# EAGLE schematic PSPS_AVNC_SRD_fullBoard-2020-02-06-2 (EAGLE 9.5.1)
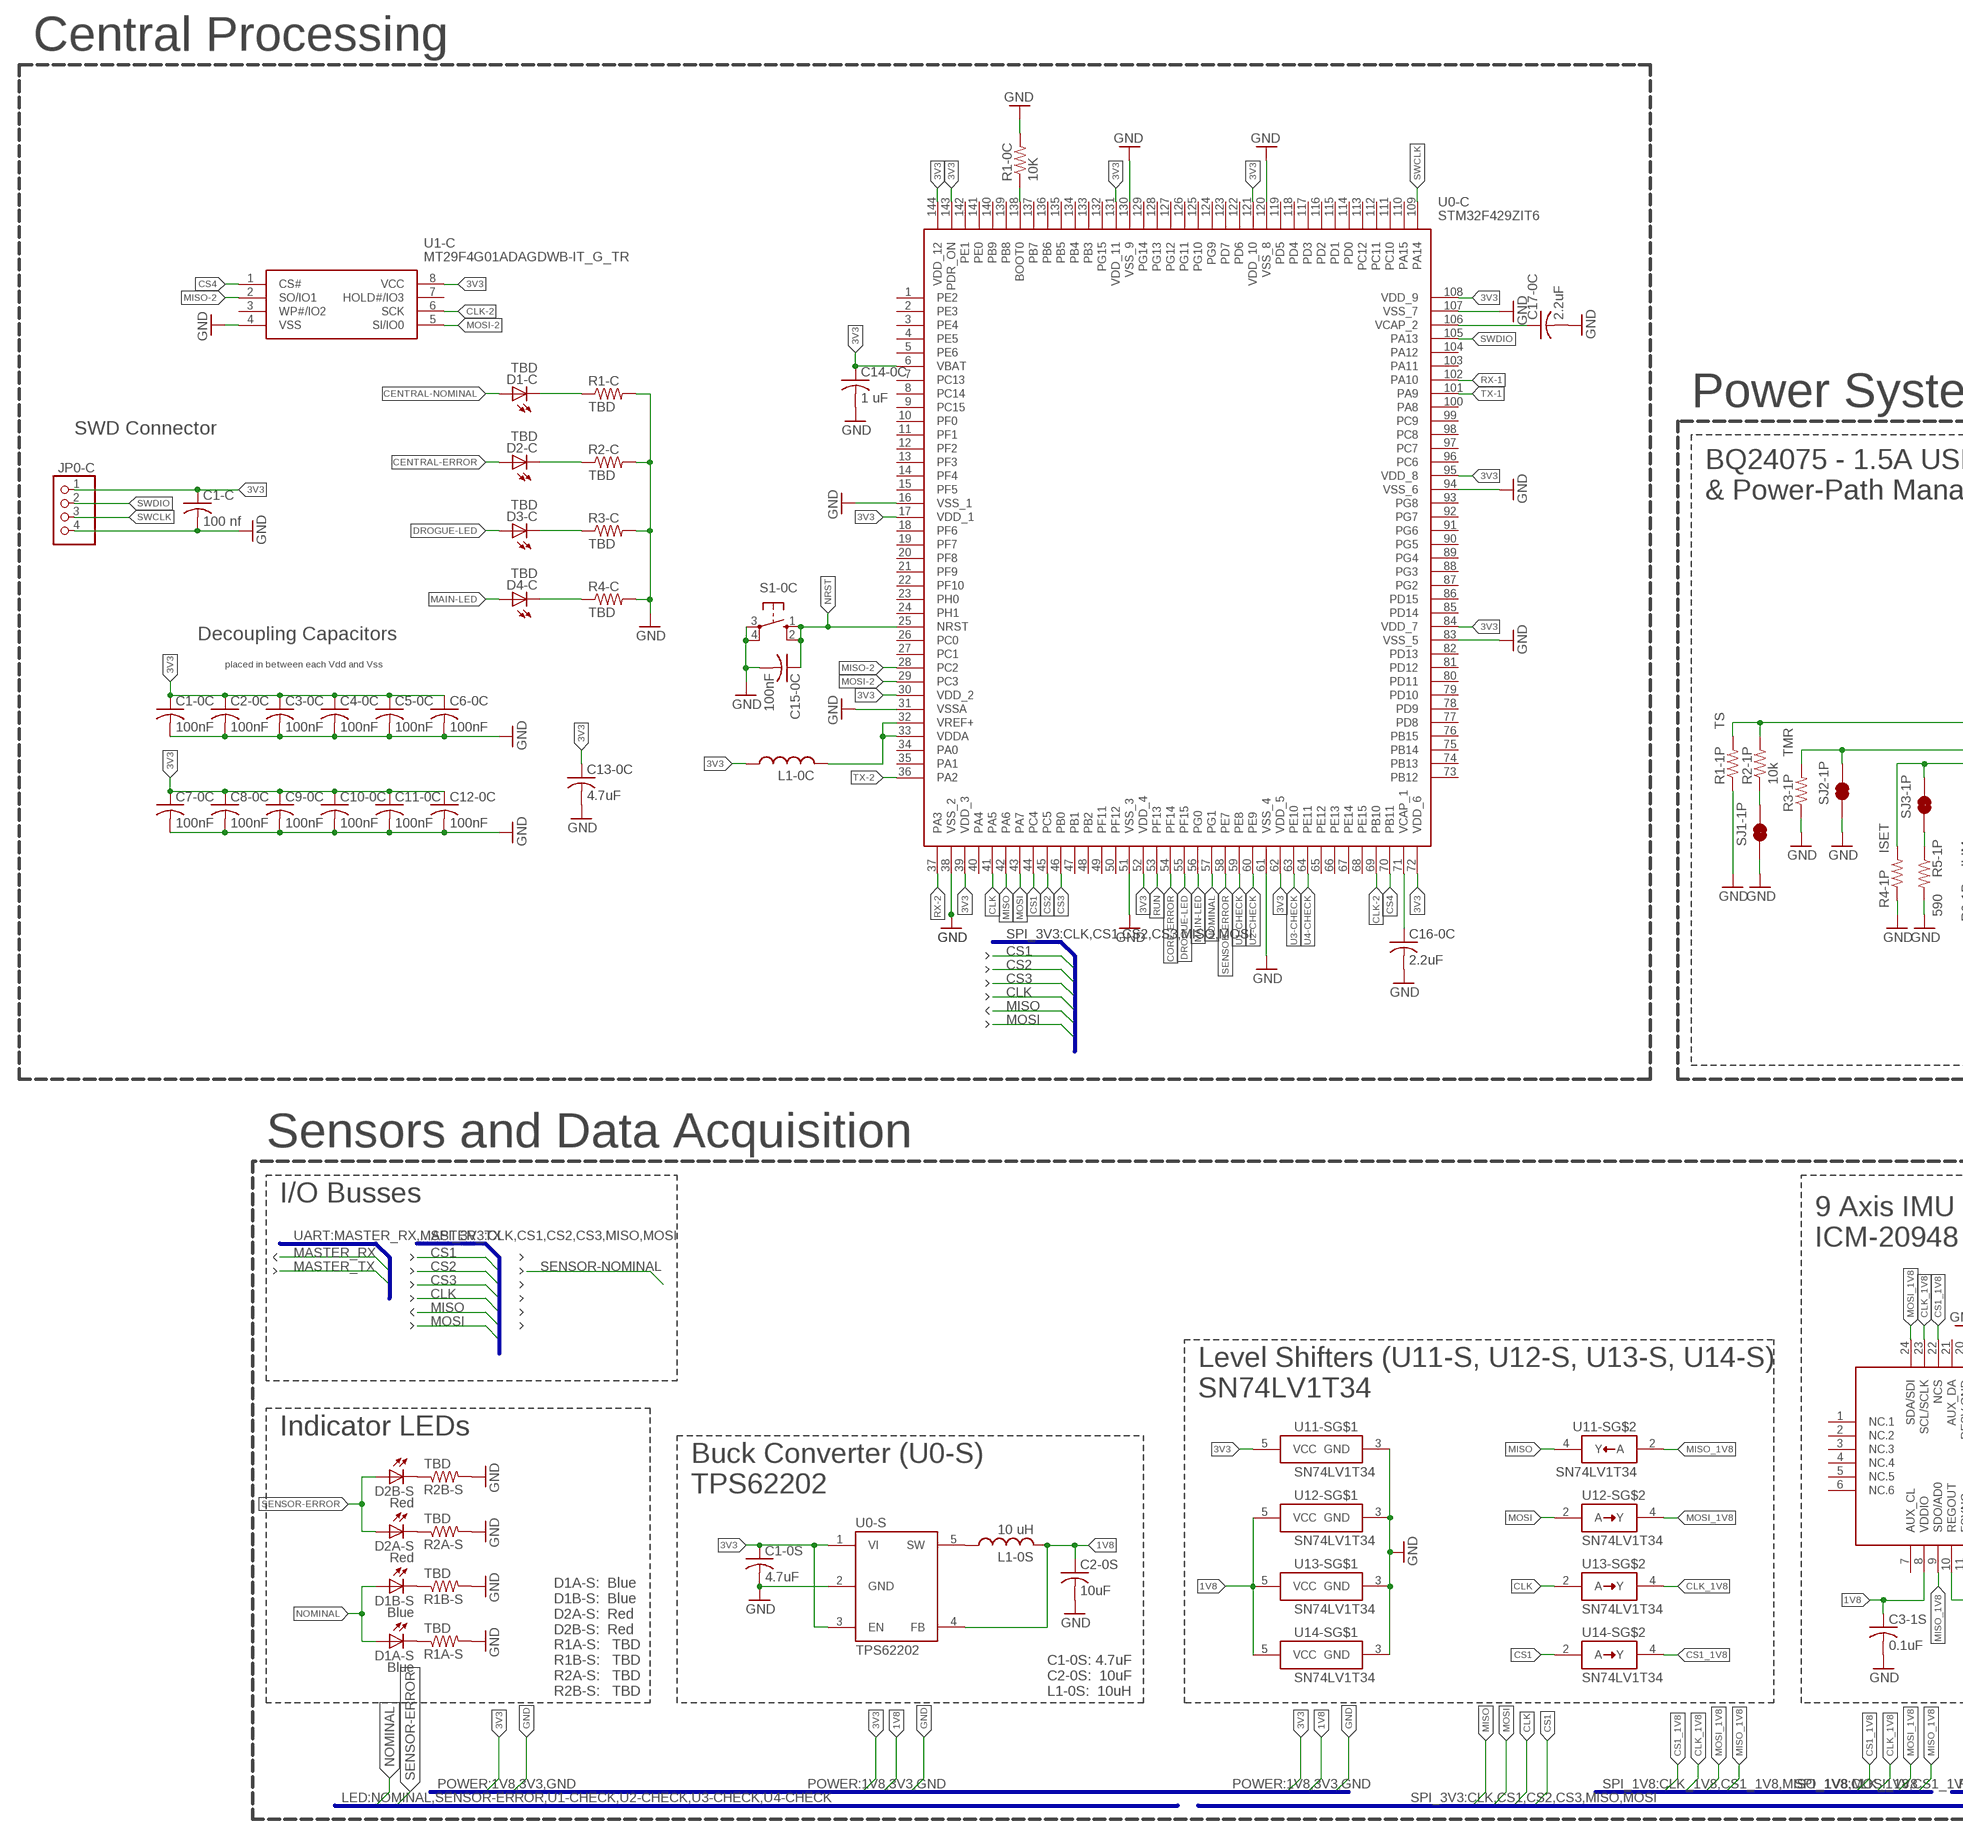
[diagram p0: schematic, sheet 1, part 1 of 3]
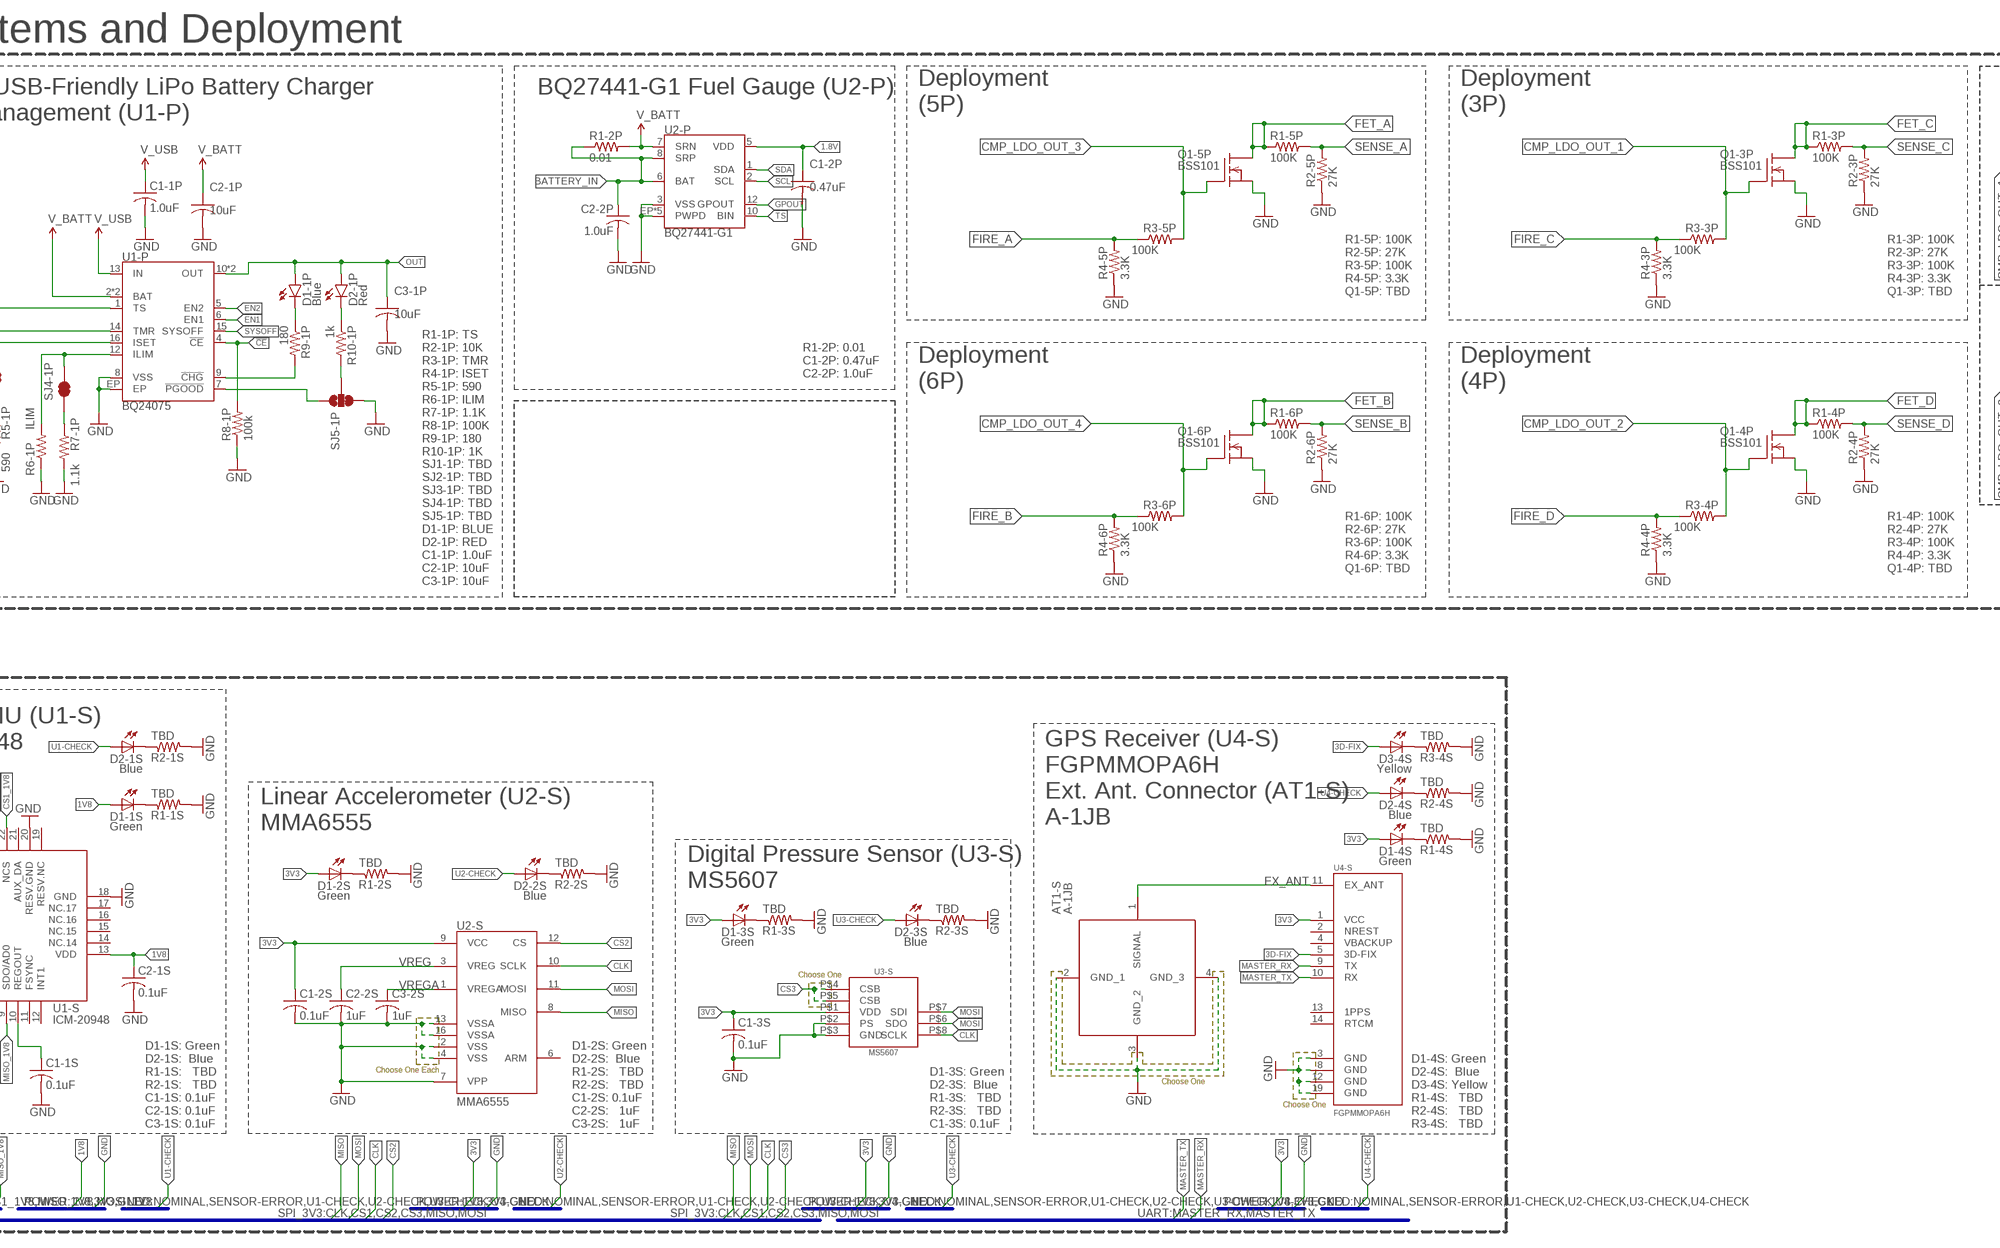
[diagram p1: schematic, sheet 1, part 2 of 3]
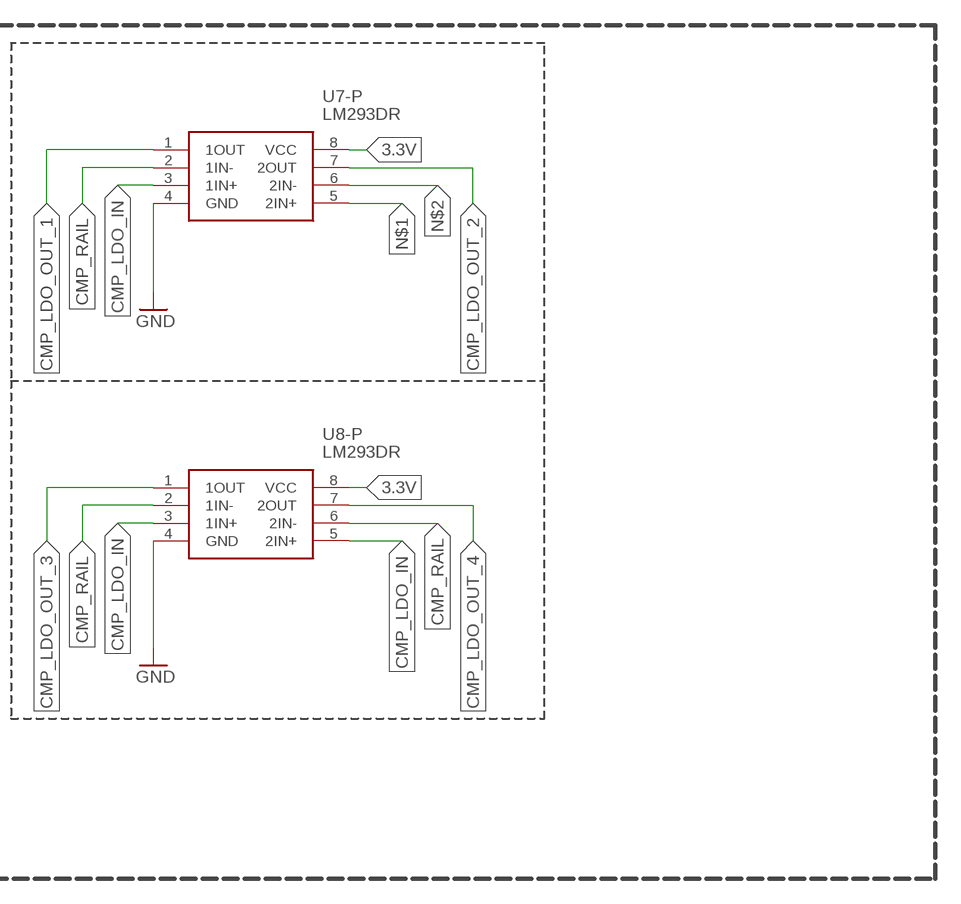
[diagram p2: schematic, sheet 1, part 3 of 3]

## Parts
AT1-S  A-1JB  [A1JB]
C1-0C  100nF  C-USC0805  [C0805]
C1-0S  4.7uF  C-USC0805  [C0805]
C1-1P  1.0uF  C-USC0805  [C0805]
C1-1S  0.1uF  C-USC0805  [C0805]
C1-2P  0.47uF  C-USC0805  [C0805]
C1-2S  0.1uF  C-USC0805  [C0805]
C1-3S  0.1uF  C-USC0805  [C0805]
C1-C  100 nf  C-USC0805  [C0805]
C2-0C  100nF  C-USC0805  [C0805]
C2-0S  10uF  C-USC0805  [C0805]
C2-1P  10uF  C-USC0805  [C0805]
C2-1S  0.1uF  C-USC0805  [C0805]
C2-2P  1.0uF  C-USC0805  [C0805]
C2-2S  1uF  C-USC0805  [C0805]
C3-0C  100nF  C-USC0805  [C0805]
C3-1P  10uF  C-USC0805  [C0805]
C3-1S  0.1uF  C-USC0805  [C0805]
C3-2S  1uF  C-USC0805  [C0805]
C4-0C  100nF  C-USC0805  [C0805]
C5-0C  100nF  C-USC0805  [C0805]
C6-0C  100nF  C-USC0805  [C0805]
C7-0C  100nF  C-USC0805  [C0805]
C8-0C  100nF  C-USC0805  [C0805]
C9-0C  100nF  C-USC0805  [C0805]
C10-0C  100nF  C-USC0805  [C0805]
C11-0C  100nF  C-USC0805  [C0805]
C12-0C  100nF  C-USC0805  [C0805]
C13-0C  4.7uF  C-USC0805  [C0805]
C14-0C  1 uF  C-USC0805  [C0805]
C15-0C  100nF  C-USC0805  [C0805]
C16-0C  2.2uF  C-USC0805  [C0805]
C17-0C  2.2uF  C-USC0805  [C0805]
D1-1P  Blue  LEDCHIP-LED0805  [CHIP-LED0805]
D1-1S  Green  LEDCHIPLED_0805  [CHIPLED_0805]
D1-2S  Green  LEDCHIPLED_0805  [CHIPLED_0805]
D1-3S  Green  LEDCHIPLED_0805  [CHIPLED_0805]
D1-4S  Green  LEDCHIPLED_0805  [CHIPLED_0805]
D1-C  TBD  LEDCHIPLED_0805  [CHIPLED_0805]
D1A-S  Blue  LEDCHIPLED_0805  [CHIPLED_0805]
D1B-S  Blue  LEDCHIPLED_0805  [CHIPLED_0805]
D2-1P  Red  LEDCHIP-LED0805  [CHIP-LED0805]
D2-1S  Blue  LEDCHIPLED_0805  [CHIPLED_0805]
D2-2S  Blue  LEDCHIPLED_0805  [CHIPLED_0805]
D2-3S  Blue  LEDCHIPLED_0805  [CHIPLED_0805]
D2-4S  Blue  LEDCHIPLED_0805  [CHIPLED_0805]
D2-C  TBD  LEDCHIPLED_0805  [CHIPLED_0805]
D2A-S  Red  LEDCHIPLED_0805  [CHIPLED_0805]
D2B-S  Red  LEDCHIPLED_0805  [CHIPLED_0805]
D3-4S  Yellow  LEDCHIPLED_0805  [CHIPLED_0805]
D3-C  TBD  LEDCHIPLED_0805  [CHIPLED_0805]
D4-C  TBD  LEDCHIPLED_0805  [CHIPLED_0805]
JP0-C  PINHD-1X4  [1X04]
L1-0C  L-USL1812  [L1812]
L1-0S  10 uH  L-US  [0805]
Q1-3P  BSS101  [TO92]
Q1-4P  BSS101  [TO92]
Q1-5P  BSS101  [TO92]
Q1-6P  BSS101  [TO92]
R1-0C  10K  R-US_R0805  [R0805]
R1-1P  TS  R-US_R0805  [R0805]
R1-1S  TBD  R-US_R0805  [R0805]
R1-2P  0.01  R-US_R0805  [R0805]
R1-2S  TBD  R-US_R0805  [R0805]
R1-3P  100K  R-US_M0805  [M0805]
R1-3S  TBD  R-US_R0805  [R0805]
R1-4P  100K  R-US_M0805  [M0805]
R1-4S  TBD  R-US_R0805  [R0805]
R1-5P  100K  R-US_M0805  [M0805]
R1-6P  100K  R-US_M0805  [M0805]
R1-C  TBD  R-US_M0805  [M0805]
R1A-S  TBD  R-US_R0805  [R0805]
R1B-S  TBD  R-US_R0805  [R0805]
R2-1P  10k  R-US_R0805  [R0805]
R2-1S  TBD  R-US_R0805  [R0805]
R2-2S  TBD  R-US_R0805  [R0805]
R2-3P  27K  R-US_M0805  [M0805]
R2-3S  TBD  R-US_R0805  [R0805]
R2-4P  27K  R-US_M0805  [M0805]
R2-4S  TBD  R-US_R0805  [R0805]
R2-5P  27K  R-US_M0805  [M0805]
R2-6P  27K  R-US_M0805  [M0805]
R2-C  TBD  R-US_M0805  [M0805]
R2A-S  TBD  R-US_R0805  [R0805]
R2B-S  TBD  R-US_R0805  [R0805]
R3-1P  TMR  R-US_R0805  [R0805]
R3-3P  100K  R-US_M0805  [M0805]
R3-4P  100K  R-US_M0805  [M0805]
R3-4S  TBD  R-US_R0805  [R0805]
R3-5P  100K  R-US_M0805  [M0805]
R3-6P  100K  R-US_M0805  [M0805]
R3-C  TBD  R-US_M0805  [M0805]
R4-1P  ISET  R-US_R0805  [R0805]
R4-3P  3.3K  R-US_M0805  [M0805]
R4-4P  3.3K  R-US_M0805  [M0805]
R4-5P  3.3K  R-US_M0805  [M0805]
R4-6P  3.3K  R-US_M0805  [M0805]
R4-C  TBD  R-US_M0805  [M0805]
R5-1P  590  R-US_R0805  [R0805]
R6-1P  ILIM  R-US_R0805  [R0805]
R7-1P  1.1k  R-US_R0805  [R0805]
R8-1P  100k  R-US_R0805  [R0805]
R9-1P  180  R-US_R0805  [R0805]
R10-1P  1k  R-US_R0805  [R0805]
S1-0C  10-XX  [B3F-10XX]
SJ1-1P  JUMPER-PAD-2-NC_BY_TRACE  [PAD-JUMPER-2-NC_BY_TRACE_YES_SILK]
SJ2-1P  JUMPER-PAD-2-NC_BY_TRACE  [PAD-JUMPER-2-NC_BY_TRACE_YES_SILK]
SJ3-1P  JUMPER-PAD-2-NC_BY_TRACE  [PAD-JUMPER-2-NC_BY_TRACE_YES_SILK]
SJ4-1P  JUMPER-PAD-2-NC_BY_TRACE  [PAD-JUMPER-2-NC_BY_TRACE_YES_SILK]
SJ5-1P  JUMPER-PAD-3-2OF3_NC_BY_TRACE_SMALL  [PAD-JUMPER-3-2OF3_NC_BY_TRACE_YES_SILK_FULL_BOX]
U0-C  STM32F429ZIT6  [QFP50P2200X2200X160-144N]
U0-S  TPS62202  [SOT95P280X145-5]
U1-C  MT29F4G01ADAGDWB-IT_G_TR  [SON127P800X600X65-8N]
U1-P  BQ24075  [PVQFN-N16]
U1-S  ICM-20948  [QFN40P300X300X105-25T159X175]
U2-P  BQ27441-G1  [PDSO-N12]
U2-S  MMA6555  MMA655X  [QFN100P600X600X198-17T424N]
U3-S  MS5607  [MS5607]
U4-S  FGPMMOPA6H  [SOIC127P1800X470-20N]
U7-P  LM293DR  [SOIC127P600X175-8N]
U8-P  LM293DR  [SOIC127P600X175-8N]
U11-S  SN74LV1T34  [SOT65P210X110-5]
U12-S  SN74LV1T34  [SOT65P210X110-5]
U13-S  SN74LV1T34  [SOT65P210X110-5]
U14-S  SN74LV1T34  [SOT65P210X110-5]

## Nets
1.8V: C1-2P.1 U2-P.5(VDD)
1V8: C2-0S.1 C2-1S.1 C3-1S.1 D1-1S.A L1-0S.2 U0-S.4(FB) U1-S.8(VDDIO) U1-S.13(VDD) U12-S.5(VCC) U13-S.5(VCC) U14-S.5(VCC)
3.3V: U7-P.8(VCC) U8-P.8(VCC)
3D-FIX: D3-4S.A U4-S.5(3D-FIX)
3V3: C1-0C.1 C1-0S.1 C1-2S.1 C1-3S.1 C1-C.1 C2-0C.1 C3-0C.1 C4-0C.1 C5-0C.1 C6-0C.1 C7-0C.1 C8-0C.1 C9-0C.1 C10-0C.1 C11-0C.1 C12-0C.1 C13-0C.1 C14-0C.1 D1-2S.A D1-3S.A D1-4S.A JP0-C.1 L1-0C.1 U0-C.6(VBAT) U0-C.17(VDD_1) U0-C.30(VDD_2) U0-C.39(VDD_3) U0-C.52(VDD_4) U0-C.62(VDD_5) U0-C.72(VDD_6) U0-C.84(VDD_7) U0-C.95(VDD_8) U0-C.108(VDD_9) U0-C.121(VDD_10) U0-C.131(VDD_11) U0-C.143(PDR_ON) U0-C.144(VDD_12) U0-S.1(VI) U0-S.3(EN) U1-C.8(VCC) U2-S.9(VCC) U3-S.P$1(VDD) U4-S.1(VCC) U11-S.5(VCC)
!CE!: R8-1P.2 U1-P.4(!CE!)
!CHG!: R9-1P.2 U1-P.9(!CHG!)
!PGOOD!: SJ5-1P.1 U1-P.7(!PGOOD!)
BATTERY_IN: C2-2P.1 R1-2P.1 U2-P.6(BAT) U2-P.8(SRP)
BOOT0: R1-0C.1 U0-C.138(BOOT0)
CENTRAL-ERROR: D2-C.A
CENTRAL-NOMINAL: D1-C.A
CLK: U0-C.41(PA5) U2-S.10(SCLK) U3-S.P$8(SCLK) U13-S.2(A)
CLK-2: U0-C.69(PB10) U1-C.6(SCK)
CLK_1V8: U1-S.23(SCL/SCLK) U13-S.4(Y)
CMP_LDO_IN: U7-P.3(1IN+) U8-P.3(1IN+) U8-P.5(2IN+)
CMP_LDO_OUT_1: Q1-3P.2(G) R3-3P.2 U7-P.1(1OUT)
CMP_LDO_OUT_2: Q1-4P.2(G) R3-4P.2 U7-P.7(2OUT)
CMP_LDO_OUT_3: Q1-5P.2(G) R3-5P.2 U8-P.1(1OUT)
CMP_LDO_OUT_4: Q1-6P.2(G) R3-6P.2 U8-P.7(2OUT)
CMP_RAIL: U7-P.2(1IN-) U8-P.2(1IN-) U8-P.6(2IN-)
CORE-ERROR: U0-C.54(PF14)
CS1: U0-C.44(PC4) U14-S.2(A)
CS1_1V8: U1-S.22(NCS) U14-S.4(Y)
CS2: U0-C.45(PC5) U2-S.12(CS)
CS3: U0-C.46(PB0) U3-S.P$4(CSB) U3-S.P$5(CSB)
CS4: U0-C.70(PB11) U1-C.1(CS#)
D1-1P_R9-1P: D1-1P.C R9-1P.1
D1-1S_R1-1S: D1-1S.C R1-1S.1
D1-2S_R1-2S: D1-2S.C R1-2S.1
D1-3S_R1-3S: D1-3S.C R1-3S.1
D1-4S_R1-4S: D1-4S.C R1-4S.1
D1-C_R1-C: D1-C.C R1-C.1
D1A-S_R1A-S: D1A-S.C R1A-S.1
D1B-S_R1B-S: D1B-S.C R1B-S.1
D2-1P_R10-1P: D2-1P.C R10-1P.1
D2-1S_R2-1S: D2-1S.C R2-1S.1
D2-2S_R2-2S: D2-2S.C R2-2S.1
D2-3S_R2-3S: D2-3S.C R2-3S.1
D2-4S_R2-4S: D2-4S.C R2-4S.1
D2-C_R2-C: D2-C.C R2-C.1
D2A-S_R2A-S: D2A-S.C R2A-S.1
D2B-S_R2B-S: D2B-S.C R2B-S.1
D3-4S_R3-4S: D3-4S.C R3-4S.1
D3-C_R3-C: D3-C.C R3-C.1
D4-C_R4-C: D4-C.C R4-C.1
DROGUE-LED: D3-C.A U0-C.55(PF15)
EN1: U1-P.6(EN1)
EN2: U1-P.5(EN2)
EX_ANT: AT1-S.1(SIGNAL) U4-S.11(EX_ANT)
FET_A: Q1-5P.3(D) R1-5P.1
FET_B: Q1-6P.3(D) R1-6P.1
FET_C: Q1-3P.3(D) R1-3P.1
FET_D: Q1-4P.3(D) R1-4P.1
FIRE_A: R3-5P.1 R4-5P.2
FIRE_B: R3-6P.1 R4-6P.2
FIRE_C: R3-3P.1 R4-3P.2
FIRE_D: R3-4P.1 R4-4P.2
GND: AT1-S.2(GND_1) AT1-S.3(GND_2) AT1-S.4(GND_3) C1-0C.2 C1-0S.2 C1-1P.2 C1-1S.2 C1-2P.2 C1-2S.2 C1-3S.2 C1-C.2 C2-0C.2 C2-0S.2 C2-1P.2 C2-1S.2 C2-2P.2 C2-2S.2 C3-0C.2 C3-1P.2 C3-1S.2 C3-2S.2 C4-0C.2 C5-0C.2 C6-0C.2 C7-0C.2 C8-0C.2 C9-0C.2 C10-0C.2 C11-0C.2 C12-0C.2 C13-0C.2 C14-0C.2 C15-0C.2 C16-0C.2 C17-0C.2 JP0-C.4 Q1-3P.1(S) Q1-4P.1(S) Q1-5P.1(S) Q1-6P.1(S) R1-0C.2 R1-1P.1 R1-1S.2 R1-2S.2 R1-3S.2 R1-4S.2 R1-C.2 R1A-S.2 R1B-S.2 R2-1S.2 R2-2S.2 R2-3P.1 R2-3S.2 R2-4P.1 R2-4S.2 R2-5P.1 R2-6P.1 R2-C.2 R2A-S.2 R2B-S.2 R3-1P.1 R3-4S.2 R3-C.2 R4-1P.1 R4-3P.1 R4-4P.1 R4-5P.1 R4-6P.1 R4-C.2 R5-1P.2 R6-1P.1 R7-1P.2 R8-1P.1 S1-0C.3(P) S1-0C.4(P1) SJ1-1P.1 SJ2-1P.1 SJ5-1P.3 U0-C.16(VSS_1) U0-C.31(VSSA) U0-C.38(VSS_2) U0-C.51(VSS_3) U0-C.61(VSS_4) U0-C.83(VSS_5) U0-C.94(VSS_6) U0-C.107(VSS_7) U0-C.120(VSS_8) U0-C.130(VSS_9) U0-S.2(GND) U1-C.4(VSS) U1-P.8(VSS) U1-P.EP U1-S.18(GND) U1-S.20(RESV.GND) U2-P.3(VSS) U2-P.EP1(PWPD) U2-P.EP2(PWPD) U2-P.EP3(PWPD) U2-P.EP4(PWPD) U2-P.EP(PWPD) U2-S.2(VSS) U2-S.4(VSS) U2-S.7(VPP) U2-S.13(VSSA) U2-S.16(VSSA) U3-S.P$2(PS) U3-S.P$3(GND) U4-S.3(GND) U4-S.8(GND) U4-S.12(GND) U4-S.19(GND) U7-P.4(GND) U8-P.4(GND) U11-S.3(GND) U12-S.3(GND) U13-S.3(GND) U14-S.3(GND)
GPOUT: U2-P.12(GPOUT)
ILIM: R6-1P.2 SJ4-1P.2 U1-P.12(ILIM)
ISET: R4-1P.2 SJ3-1P.2 U1-P.16(ISET)
MAIN-LED: D4-C.A U0-C.56(PG0)
MASTER_RX: U4-S.9(TX)
MASTER_TX: U4-S.10(RX)
MISO: U0-C.42(PA6) U2-S.8(MISO) U11-S.4(Y)
MISO-2: U0-C.28(PC2) U1-C.2(SO/IO1)
MISO_1V8: U1-S.9(SDO/AD0) U11-S.2(A)
MOSI: U0-C.43(PA7) U2-S.11(MOSI) U3-S.P$6(SDO) U3-S.P$7(SDI) U12-S.2(A)
MOSI-2: U0-C.29(PC3) U1-C.5(SI/IO0)
MOSI_1V8: U1-S.24(SDA/SDI) U12-S.4(Y)
N$1: U7-P.5(2IN+)
N$2: U7-P.6(2IN-)
NOMINAL: D1A-S.A D1B-S.A U0-C.57(PG1)
NRST: C15-0C.1 S1-0C.1(S) S1-0C.2(S1) U0-C.25(NRST)
OUT: C3-1P.1 D1-1P.A D2-1P.A U1-P.10(OUT) U1-P.11(OUT)
R2-1P_SJ1P: R2-1P.1 SJ1-1P.2
R10-1P_SJ5-P: R10-1P.2 SJ5-1P.2
REGOUT: C1-1S.1 U1-S.10(REGOUT)
RUN: U0-C.53(PF13)
RX-1: U0-C.102(PA10)
RX-2: U0-C.37(PA3)
SCL: U2-P.2(SCL)
SDA: U2-P.1(SDA)
SENSE_A: R1-5P.2 R2-5P.2
SENSE_B: R1-6P.2 R2-6P.2
SENSE_C: R1-3P.2 R2-3P.2
SENSE_D: R1-4P.2 R2-4P.2
SENSOR-ERROR: D2A-S.A D2B-S.A U0-C.58(PE7)
SJ3-P_R5-1P: R5-1P.1 SJ3-1P.1
SJ4-P_R7-1P: R7-1P.1 SJ4-1P.1
SW: L1-0S.1 U0-S.5(SW)
SWCLK: JP0-C.3 U0-C.109(PA14)
SWDIO: JP0-C.2 U0-C.105(PA13)
SYSOFF: U1-P.15(SYSOFF)
TMR: R3-1P.2 SJ2-1P.2 U1-P.14(TMR)
TS: U2-P.10(BIN)
TS1: R1-1P.2 R2-1P.2 U1-P.1(TS)
TX-1: U0-C.101(PA9)
TX-2: U0-C.36(PA2)
U1-CHECK: D2-1S.A U0-C.59(PE8)
U2-CHECK: D2-2S.A U0-C.60(PE9)
U3-CHECK: D2-3S.A U0-C.63(PE10)
U4-CHECK: D2-4S.A U0-C.64(PE11)
V_BATT: C2-1P.1 R1-2P.2 U1-P.2(BAT) U1-P.3(BAT) U2-P.7(SRN)
V_USB: C1-1P.1 U1-P.13(IN)
VCAP_1: C16-0C.1 U0-C.71(VCAP_1)
VCAP_2: C17-0C.1 U0-C.106(VCAP_2)
VDDA: L1-0C.2 U0-C.32(VREF+) U0-C.33(VDDA)
VREG: C2-2S.1 U2-S.3(VREG)
VREGA: C3-2S.1 U2-S.1(VREGA)
Unconnected: U0-C.1(PE2) U0-C.2(PE3) U0-C.3(PE4) U0-C.4(PE5) U0-C.5(PE6) U0-C.7(PC13) U0-C.8(PC14) U0-C.9(PC15) U0-C.10(PF0) U0-C.11(PF1) U0-C.12(PF2) U0-C.13(PF3) U0-C.14(PF4) U0-C.15(PF5) U0-C.18(PF6) U0-C.19(PF7) U0-C.20(PF8) U0-C.21(PF9) U0-C.22(PF10) U0-C.23(PH0) U0-C.24(PH1) U0-C.26(PC0) U0-C.27(PC1) U0-C.34(PA0) U0-C.35(PA1) U0-C.40(PA4) U0-C.47(PB1) U0-C.48(PB2) U0-C.49(PF11) U0-C.50(PF12) U0-C.65(PE12) U0-C.66(PE13) U0-C.67(PE14) U0-C.68(PE15) U0-C.73(PB12) U0-C.74(PB13) U0-C.75(PB14) U0-C.76(PB15) U0-C.77(PD8) U0-C.78(PD9) U0-C.79(PD10) U0-C.80(PD11) U0-C.81(PD12) U0-C.82(PD13) U0-C.85(PD14) U0-C.86(PD15) U0-C.87(PG2) U0-C.88(PG3) U0-C.89(PG4) U0-C.90(PG5) U0-C.91(PG6) U0-C.92(PG7) U0-C.93(PG8) U0-C.96(PC6) U0-C.97(PC7) U0-C.98(PC8) U0-C.99(PC9) U0-C.100(PA8) U0-C.103(PA11) U0-C.104(PA12) U0-C.110(PA15) U0-C.111(PC10) U0-C.112(PC11) U0-C.113(PC12) U0-C.114(PD0) U0-C.115(PD1) U0-C.116(PD2) U0-C.117(PD3) U0-C.118(PD4) U0-C.119(PD5) U0-C.122(PD6) U0-C.123(PD7) U0-C.124(PG9) U0-C.125(PG10) U0-C.126(PG11) U0-C.127(PG12) U0-C.128(PG13) U0-C.129(PG14) U0-C.132(PG15) U0-C.133(PB3) U0-C.134(PB4) U0-C.135(PB5) U0-C.136(PB6) U0-C.137(PB7) U0-C.139(PB8) U0-C.140(PB9) U0-C.141(PE0) U0-C.142(PE1) U1-C.3(WP#/IO2) U1-C.7(HOLD#/IO3) U1-S.1(NC.1) U1-S.2(NC.2) U1-S.3(NC.3) U1-S.4(NC.4) U1-S.5(NC.5) U1-S.6(NC.6) U1-S.7(AUX_CL) U1-S.11(FSYNC) U1-S.12(INT1) U1-S.14(NC.14) U1-S.15(NC.15) U1-S.16(NC.16) U1-S.17(NC.17) U1-S.19(RESV.NC) U1-S.21(AUX_DA) U2-S.6(ARM) U4-S.2(NREST) U4-S.4(VBACKUP) U4-S.13(1PPS) U4-S.14(RTCM)

## Buses
SPI_3V3:CLK,CS1,CS2,CS3,MISO,MOSI
SPI_1V8:CLK_1V8,CS1_1V8,MISO_1V8,MOSI_1V8
POWER:1V8,3V3,GND
LED:NOMINAL,SENSOR-ERROR,U1-CHECK,U2-CHECK,U3-CHECK,U4-CHECK
UART:MASTER_RX,MASTER_TX

## Notes on the sheet
- Central Processing
- Power Systems and Deployment
- SWD Connector
- BQ24075 - 1.5A USB-Friendly LiPo Battery Charger 
  & Power-Path Management (U1-P)
- BQ27441-G1 Fuel Gauge (U2-P)
- Deployment
  (5P)
- Deployment
  (3P)
- Decoupling Capacitors
- placed in between each Vdd and Vss
- R1-5P: 100K
  R2-5P: 27K
  R3-5P: 100K
  R4-5P: 3.3K
  Q1-5P: TBD
- R1-3P: 100K
  R2-3P: 27K
  R3-3P: 100K
  R4-3P: 3.3K
  Q1-3P: TBD
- R1-2P: 0.01
  C1-2P: 0.47uF
  C2-2P: 1.0uF
- Deployment
  (6P)
- Deployment
  (4P)
- R1-1P: TS
  R2-1P: 10K
  R3-1P: TMR
  R4-1P: ISET
  R5-1P: 590
  R6-1P: ILIM
  R7-1P: 1.1K
  R8-1P: 100K
  R9-1P: 180
  R10-1P: 1K
  SJ1-1P: TBD
  SJ2-1P: TBD
  SJ3-1P: TBD
  SJ4-1P: TBD
  SJ5-1P: TBD
  D1-1P: BLUE
  D2-1P: RED
  C1-1P: 1.0uF
  C2-1P: 10uF
  C3-1P: 10uF
- R1-6P: 100K
  R2-6P: 27K
  R3-6P: 100K
  R4-6P: 3.3K
  Q1-6P: TBD
- R1-4P: 100K
  R2-4P: 27K
  R3-4P: 100K
  R4-4P: 3.3K
  Q1-4P: TBD
- Sensors and Data Acquisition
- I/O Busses
- 9 Axis IMU (U1-S)
  ICM-20948
- GPS Receiver (U4-S)
  FGPMMOPA6H
  Ext. Ant. Connector (AT1-S)
  A-1JB
- Linear Accelerometer (U2-S)
  MMA6555
- Level Shifters (U11-S, U12-S, U13-S, U14-S)
  SN74LV1T34
- Digital Pressure Sensor (U3-S)
  MS5607
- Indicator LEDs
- Buck Converter (U0-S)
  TPS62202
- Choose One
- Choose One Each
- Choose One
- Choose One
- D1A-S:  Blue
  D1B-S:  Blue
  D2A-S:  Red
  D2B-S:  Red
  R1A-S:   TBD
  R1B-S:   TBD
  R2A-S:   TBD
  R2B-S:   TBD
- C1-0S: 4.7uF
  C2-0S:  10uF
  L1-0S:  10uH
- D1-1S: Green
  D2-1S:  Blue
  R1-1S:   TBD
  R2-1S:   TBD
  C1-1S: 0.1uF
  C2-1S: 0.1uF
  C3-1S: 0.1uF
- D1-2S: Green
  D2-2S:  Blue
  R1-2S:   TBD
  R2-2S:   TBD
  C1-2S: 0.1uF
  C2-2S:   1uF
  C3-2S:   1uF
- D1-3S: Green
  D2-3S:  Blue
  R1-3S:   TBD
  R2-3S:   TBD
  C1-3S: 0.1uF
- D1-4S: Green
  D2-4S:  Blue
  D3-4S: Yellow
  R1-4S:   TBD
  R2-4S:   TBD
  R3-4S:   TBD

## Library data of the parts
AT1-S = SamacSys_Parts:A-1JB: AMC Straight PCB Jack, Surface Mount Source: Datasheet <https://componentsearchengine.com/Datasheets/1/A-1JB.pdf>; DESCRIPTION: AMC Straight PCB Jack, Surface Mount; HEIGHT: 1.05mm; MANUFACTURER_NAME: Amphenol; MANUFACTURER_PART_NUMBER: A-1JB; MOUSER_PART_NUMBER: 523-A-1JB; MOUSER_PRICE-STOCK: https://www.mouser.com/Search/Refine.aspx?Keyword=523-A-1JB
C1-0C C1-C C2-0C C3-0C C4-0C C5-0C C6-0C C7-0C C8-0C C9-0C C10-0C C11-0C C12-0C C13-0C C14-0C C15-0C C16-0C C17-0C = rcl:C-US: CAPACITOR, American symbol; SPICEPREFIX: C
C1-0S C1-1P C1-1S C1-2S C1-3S C2-0S C2-1P C2-1S C2-2P C2-2S C3-1P C3-1S C3-2S = resistor:C-US: CAPACITOR, American symbol
C1-2P = resistor:C-US: CAPACITOR, American symbol; PROD_ID: CAP-13216
D1-1P D2-1P = led:LED: LED
D1-1S D1-2S D1-3S D1-4S D1-C D1A-S D1B-S D2-1S D2-2S D2-3S D2-4S D2-C D2A-S D2B-S D3-4S D3-C D4-C = adafruit:LED: LED
JP0-C = pinhead:PINHD-1X4: PIN HEADER
L1-0C = rcl:L-US: INDUCTOR, American symbol; SPICEPREFIX: L
L1-0S = Computer2:L-US
Q1-3P Q1-4P Q1-5P Q1-6P = transistor-fet:BSS101: N-Channel Enhancement MOSFET 200V; 0,16A; 11Ohm
R1-0C R1-3P R1-4P R1-5P R1-6P R1-C R2-3P R2-4P R2-5P R2-6P R2-C R3-3P R3-4P R3-5P R3-6P R3-C R4-3P R4-4P R4-5P R4-6P R4-C = rcl:R-US_: RESISTOR, American symbol; SPICEPREFIX: R
R1-1P R1-1S R1-2P R1-2S R1-3S R1-4S R1A-S R1B-S R2-1P R2-1S R2-2S R2-3S R2-4S R2A-S R2B-S R3-1P R3-4S R4-1P R6-1P R8-1P R9-1P R10-1P = resistor:R-US_: RESISTOR, American symbol
R5-1P = resistor:R-US_: RESISTOR, American symbol; PROD_ID: RES-13217
R7-1P = resistor:R-US_: RESISTOR, American symbol; PROD_ID: RES-10447
S1-0C = switch-omron:10-XX: OMRON SWITCH; MPN: B3F-1000; OC_FARNELL: 176432; OC_NEWARK: 36M3542
SJ1-1P SJ2-1P SJ3-1P SJ4-1P = SparkFun-Passives:JUMPER-PAD-2-NC_BY_TRACE
SJ5-1P = SparkFun-Passives:JUMPER-PAD-3-2OF3_NC_BY_TRACE
U0-C = SamacSys_Parts:STM32F429ZIT6: 32-Bit MCU+FPU M4 2MB LCD-TFT LQFP144 STMicroelectronics STM32F429ZIT6, 32bit ARM Cortex M4 MCU, 180MHz, 2048 kB Flash, 144-Pin LQFP Source: Datasheet <https://componentsearchengine.com/Datasheets/1/STM32F429ZIT6.pdf>; DESCRIPTION: 32-Bit MCU+FPU M4 2MB LCD-TFT LQFP144 STMicroelectronics STM32F429ZIT6, 32bit ARM Cortex M4 MCU, 180MHz, 2048 kB Flash, 144-Pin LQFP; HEIGHT: 1.6mm; MANUFACTURER_NAME: STMicroelectronics; MANUFACTURER_PART_NUMBER: STM32F429ZIT6; MOUSER_PART_NUMBER: 511-STM32F429ZIT6; MOUSER_PRICE-STOCK: https://www.mouser.com/Search/Refine.aspx?Keyword=511-STM32F429ZIT6
U0-S = Computer2:TPS62202: 1.8-V Output, 300-mA, 95% Efficient Step-Down Converter in SOT-23 http://www.ti.com/product/TPS62202
U1-C = SamacSys_Parts:MT29F4G01ADAGDWB-IT_G_TR: IC FLASH 4GBIT 8UDFN Source: Datasheet <https://www.micron.com/resource-details/2a12c9c5-e087-4fd9-927b-8df8a61ec896>; DESCRIPTION: IC FLASH 4GBIT 8UDFN; HEIGHT: 0.65mm; MANUFACTURER_NAME: Micron; MANUFACTURER_PART_NUMBER: MT29F4G01ADAGDWB-IT:G TR; MOUSER_PART_NUMBER: 340-319958-REEL; MOUSER_PRICE-STOCK: https://www.mouser.com/Search/Refine.aspx?Keyword=340-319958-REEL
U1-P = battery-management-temp:BQ24075; PROD_ID: IC-13219
U1-S = Computer2:ICM-20948: 9 Axis Motion Sensor from TDK InvenSense https://store.invensense.com/products/detail/ICM20948-InvenSense/597203/
U2-P = battery-management-temp:BQ27441-G1; PROD_ID: IC-13220
U2-S = Computer2:MMA655X: MMA655x, Single-Axis, SPI Inertial Sensor MMA655x, a SafeAssure solution, is a SPI-based, single-axis, medium-g, over- damped lateral accelerometer designed for use in Automotive Airbag systems. Features • ±105 g or ±120 g full-scale range • 3.3 V or 5 V single supply operation • SPI-compatible serial interface • 12-bit digital signed or unsigned SPI data output • Programmable arming function • Twelve low-pass filter options, ranging from 50 Hz to 1000 Hz • Optional offset cancellation with > 6 s averaging period and < 0.25 LSB/s slew rate • Pb-free 16-pin QFN, 6 mm x 6 mm package
U3-S = Computer2:MS5607
U4-S = Computer2:FGPMMOPA6H
U7-P U8-P = SamacSys_Parts:LM293DR: Dual differential comparator, industrial grade Source: Datasheet <http://www.ti.com/lit/gpn/lm293>; DESCRIPTION: Dual differential comparator, industrial grade; HEIGHT: 1.75mm; MANUFACTURER_NAME: Texas Instruments; MANUFACTURER_PART_NUMBER: LM293DR; MOUSER_PART_NUMBER: 595-LM293DR; MOUSER_PRICE-STOCK: https://www.mouser.com/Search/Refine.aspx?Keyword=595-LM293DR
U11-S U12-S U13-S U14-S = Computer2:SN74LV1T34: Single Power Supply BUFFER Logic Level Shifter

## Module LEVEL_SHIFTERS
Ports: 

### Library data of the parts